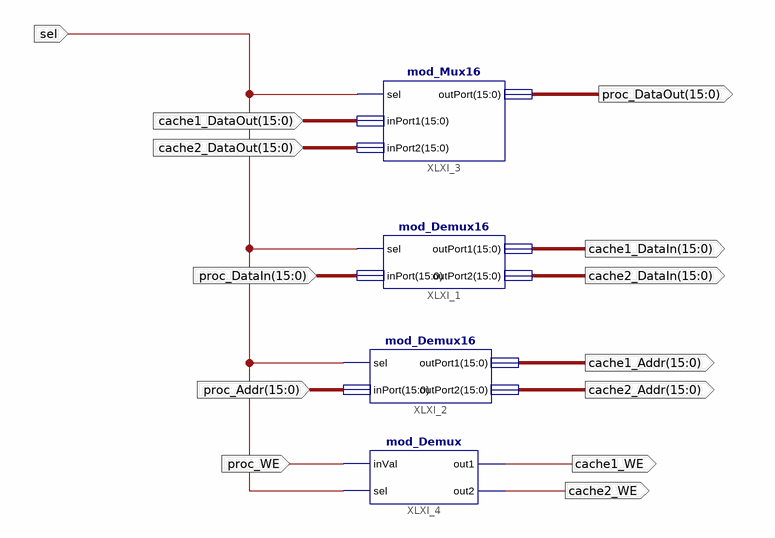
[diagram p0: schematic sheet 1]
// Xilinx ISE schematic mod_ProcMux.sch (spartan3e) as structural Verilog: 4 symbols, 13 ports
module mod_ProcMux (
  input  sel,
  input  [15:0] cache1_DataOut,
  input  [15:0] cache2_DataOut,
  input  [15:0] proc_DataIn,
  input  [15:0] proc_Addr,
  input  proc_WE,
  output [15:0] proc_DataOut,
  output [15:0] cache1_DataIn,
  output [15:0] cache2_DataIn,
  output [15:0] cache1_Addr,
  output [15:0] cache2_Addr,
  output cache1_WE,
  output cache2_WE
);

  mod_Demux16 XLXI_1 (.sel(sel), .inPort(proc_DataIn), .outPort1(cache1_DataIn), .outPort2(cache2_DataIn));
  mod_Demux16 XLXI_2 (.sel(sel), .inPort(proc_Addr), .outPort1(cache1_Addr), .outPort2(cache2_Addr));
  mod_Mux16 XLXI_3 (.sel(sel), .inPort1(cache1_DataOut), .inPort2(cache2_DataOut), .outPort(proc_DataOut));
  mod_Demux XLXI_4 (.inVal(proc_WE), .sel(sel), .out1(cache1_WE), .out2(cache2_WE));
endmodule
